# Altium schematic sheet USB JTAG.SchDoc
size A2; SheetNumber: 4; SheetTotal: 12
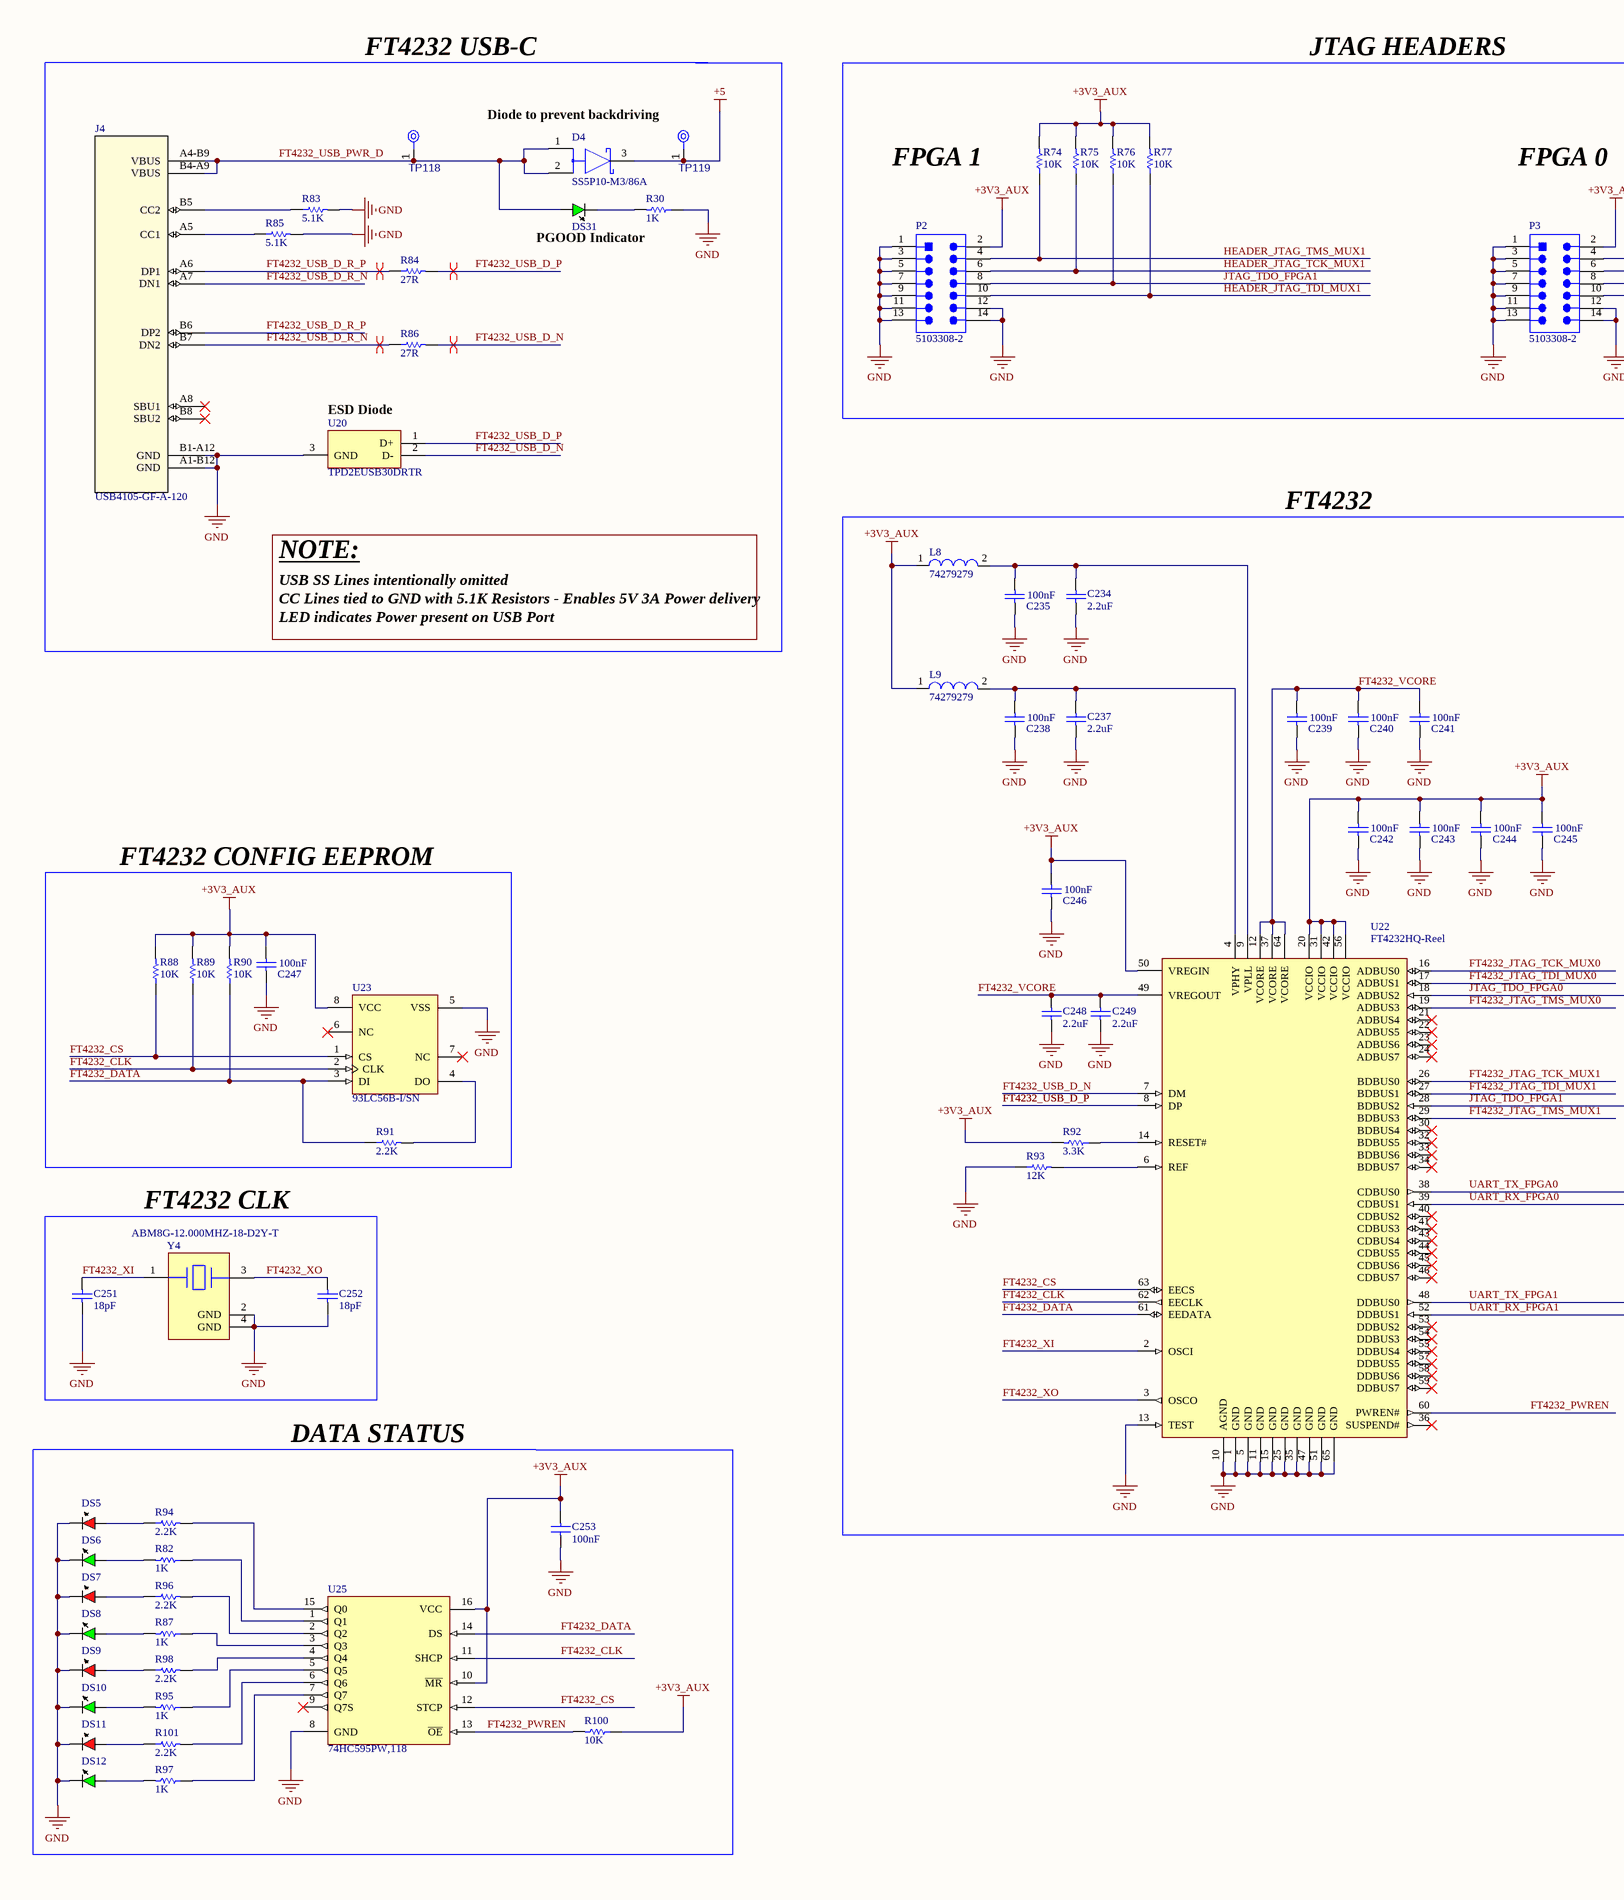
[diagram p0: USB JTAG.SchDoc, left]
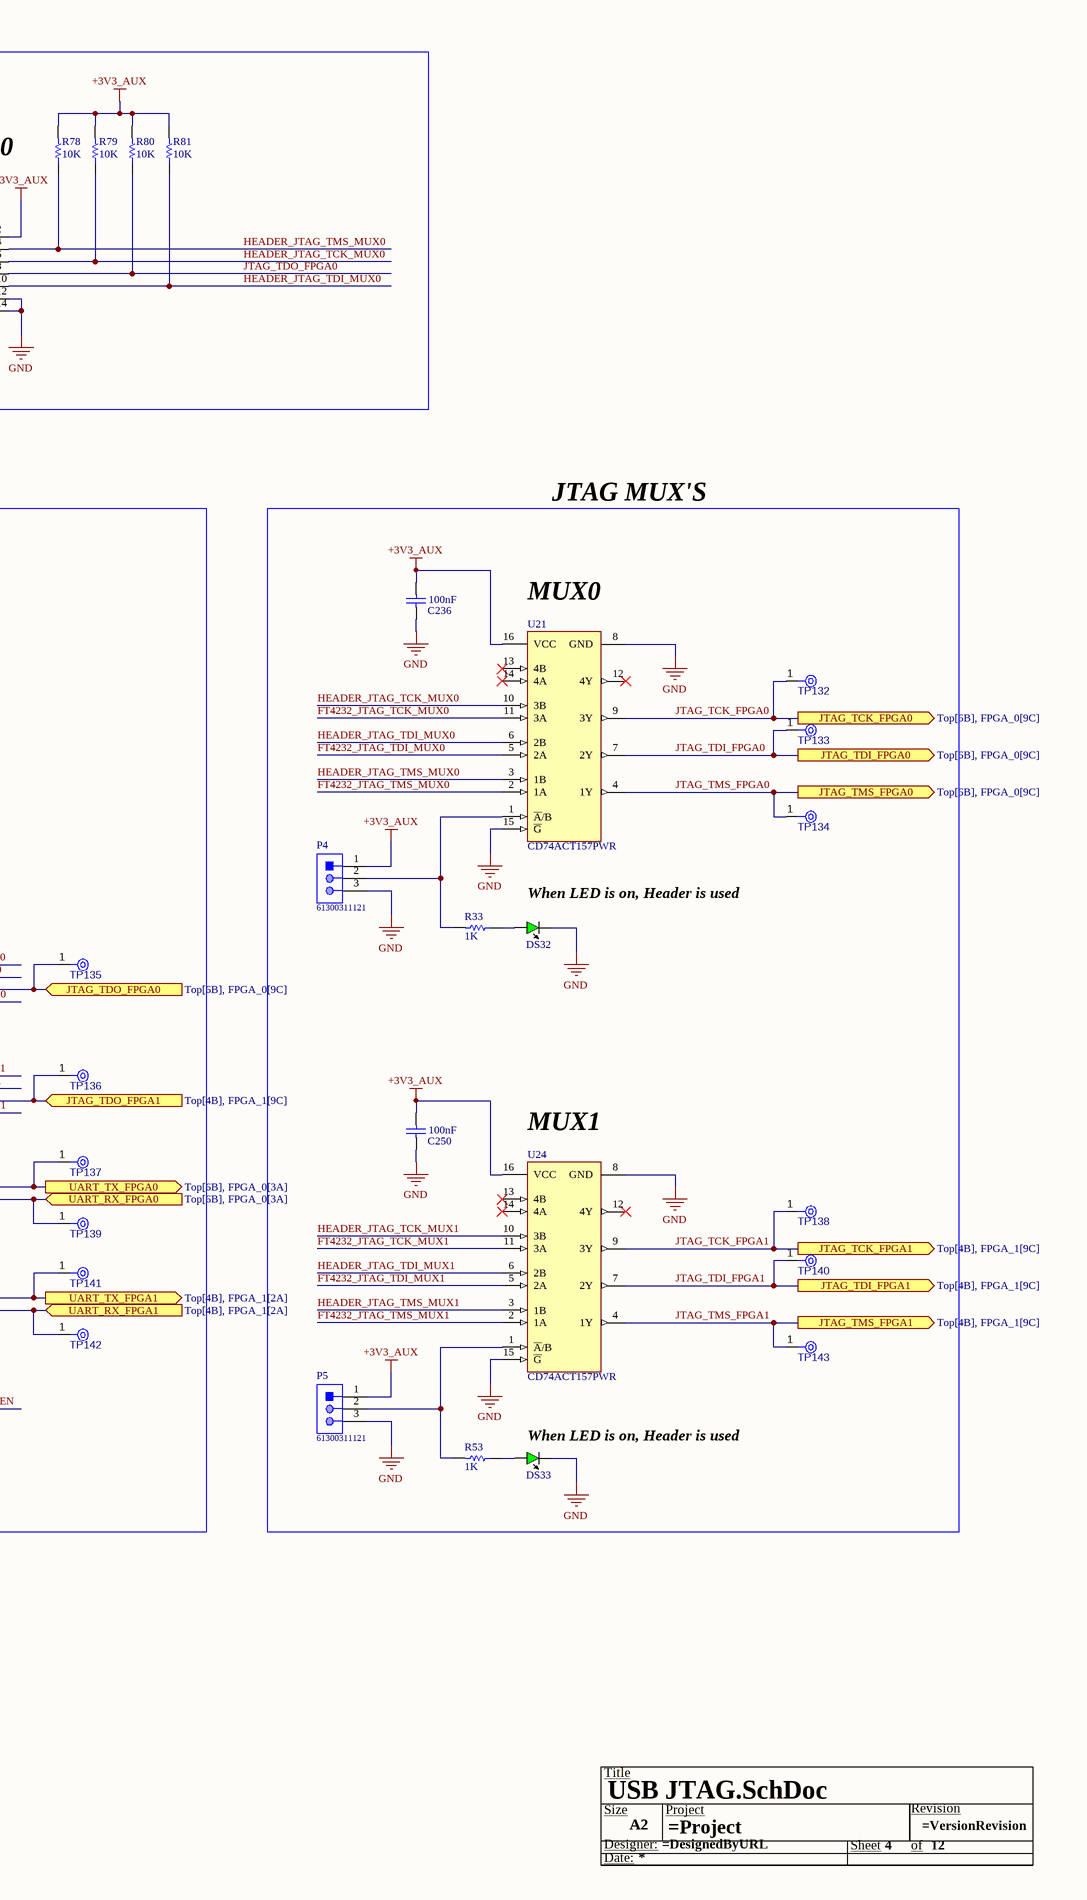
[diagram p1: USB JTAG.SchDoc, right]

## Parts
*  Size: A2  (hidden comment: Title Block)  (graphical)
C234  2.2uF  [CAPC1005X55X25NL05T10]
C235  100nF  [CAPC1005X05N]
C236  100nF  [CAPC1005X05N]
C237  2.2uF  [CAPC1005X55X25NL05T10]
C238  100nF  [CAPC1005X05N]
C239  100nF  [CAPC1005X05N]
C240  100nF  [CAPC1005X05N]
C241  100nF  [CAPC1005X05N]
C242  100nF  [CAPC1005X05N]
C243  100nF  [CAPC1005X05N]
C244  100nF  [CAPC1005X05N]
C245  100nF  [CAPC1005X05N]
C246  100nF  [CAPC1005X05N]
C247  100nF  [CAPC1005X05N]
C248  2.2uF  [CAPC1005X55X25NL05T10]
C249  2.2uF  [CAPC1005X55X25NL05T10]
C250  100nF  [CAPC1005X05N]
C251  18pF  [CAPC1005X55X25LL05T10]
C252  18pF  [CAPC1005X55X25LL05T10]
C253  100nF  [CAPC1005X05N]
D4  SS5P10-M3/86A  [FP-95570-MFG]
DS5  TLMS1100-GS08  [VISH-TLMX1100_V]  (value not drawn)
DS6  SMLLX0603GWTR  [LUMX-SML-LX0603_V]  (value not drawn)
DS7  TLMS1100-GS08  [VISH-TLMX1100_V]  (value not drawn)
DS8  SMLLX0603GWTR  [LUMX-SML-LX0603_V]  (value not drawn)
DS9  TLMS1100-GS08  [VISH-TLMX1100_V]  (value not drawn)
DS10  SMLLX0603GWTR  [LUMX-SML-LX0603_V]  (value not drawn)
DS11  TLMS1100-GS08  [VISH-TLMX1100_V]  (value not drawn)
DS12  SMLLX0603GWTR  [LUMX-SML-LX0603_V]  (value not drawn)
DS31  SMLLX0603GWTR  [LUMX-SML-LX0603_V]  (value not drawn)
DS32  SMLLX0603GWTR  [LUMX-SML-LX0603_V]  (value not drawn)
DS33  SMLLX0603GWTR  [LUMX-SML-LX0603_V]  (value not drawn)
J4  USB4105-GF-A-120  [USB4105-GF-A-120-Footprint-1]
L8  74279279  [SMD-0402]
L9  74279279  [SMD-0402]
P2  5103308-2  [TECO-5103308-2_V]
P3  5103308-2  [TECO-5103308-2_V]
P4  61300311121  [61300311121]
P5  61300311121  [61300311121]
R30  1K  [RESC1005X40X25NL05T10]
R33  1K  [RESC1005X40X25NL05T10]
R53  1K  [RESC1005X40X25NL05T10]
R74  10K  [RESC1005X40X25NL05T10]
R75  10K  [RESC1005X40X25NL05T10]
R76  10K  [RESC1005X40X25NL05T10]
R77  10K  [RESC1005X40X25NL05T10]
R78  10K  [RESC1005X40X25NL05T10]
R79  10K  [RESC1005X40X25NL05T10]
R80  10K  [RESC1005X40X25NL05T10]
R81  10K  [RESC1005X40X25NL05T10]
R82  1K  [RESC1005X40X25NL05T10]
R83  5.1K  [RESC1005X40X25NL05T10]
R84  27R  [RESC1005X40X25NL05T10]
R85  5.1K  [RESC1005X40X25NL05T10]
R86  27R  [RESC1005X40X25NL05T10]
R87  1K  [RESC1005X40X25NL05T10]
R88  10K  [RESC1005X40X25NL05T10]
R89  10K  [RESC1005X40X25NL05T10]
R90  10K  [RESC1005X40X25NL05T10]
R91  2.2K  [RESC1005X40X25NL5T10]
R92  3.3K  [RESC1005X40X25NL05T10]
R93  12K  [RESC1005X40X25NL05T05]
R94  2.2K  [RESC1005X40X25NL5T10]
R95  1K  [RESC1005X40X25NL05T10]
R96  2.2K  [RESC1005X40X25NL5T10]
R97  1K  [RESC1005X40X25NL05T10]
R98  2.2K  [RESC1005X40X25NL5T10]
R100  10K  [RESC1005X40X25NL05T10]
R101  2.2K  [RESC1005X40X25NL5T10]
TP118  TPAD6R  [TP06R]  (value not drawn)  (no BOM)
TP119  TPAD6R  [TP06R]  (value not drawn)  (no BOM)
TP132  TPAD6R  [TP06R]  (value not drawn)  (no BOM)
TP133  TPAD6R  [TP06R]  (value not drawn)  (no BOM)
TP134  TPAD6R  [TP06R]  (value not drawn)  (no BOM)
TP135  TPAD6R  [TP06R]  (value not drawn)  (no BOM)
TP136  TPAD6R  [TP06R]  (value not drawn)  (no BOM)
TP137  TPAD6R  [TP06R]  (value not drawn)  (no BOM)
TP138  TPAD6R  [TP06R]  (value not drawn)  (no BOM)
TP139  TPAD6R  [TP06R]  (value not drawn)  (no BOM)
TP140  TPAD6R  [TP06R]  (value not drawn)  (no BOM)
TP141  TPAD6R  [TP06R]  (value not drawn)  (no BOM)
TP142  TPAD6R  [TP06R]  (value not drawn)  (no BOM)
TP143  TPAD6R  [TP06R]  (value not drawn)  (no BOM)
U20  TPD2EUSB30DRTR  [DRT0003A]
U21  CD74ACT157PWR  [PW0016A_L]
U22  FT4232HQ-Reel  [QFN64_2_M]
U23  93LC56B-I/SN  [SOIC-SN8_L]
U24  CD74ACT157PWR  [PW0016A_L]
U25  74HC595PW,118  [FP-SOT403-1-MFG]
Y4  ABM8G-12.000MHZ-18-D2Y-T  [FP-ABM8G-MFG]

## Blocks framed on the sheet
FT4232: C234 C235 C237-C246 C248 C249 L8 L9 R92 R93 TP135-TP137 TP139 TP141 TP142 U22
FT4232 CONFIG EEPROM: C247 R88-R91 U23
FT4232 CLK: C251 C252 Y4
DATA STATUS: C253 DS5-DS12 R82 R87 R94-R98 R100 R101 U25

## Ports
JTAG_TCK_FPGA0 (out, see Top[6B], FPGA_0[9C]), JTAG_TCK_FPGA1 (out, see Top[4B], FPGA_1[9C]), JTAG_TDI_FPGA0 (out, see Top[6B], FPGA_0[9C]), JTAG_TDI_FPGA1 (out, see Top[4B], FPGA_1[9C]), JTAG_TDO_FPGA0 (in, see Top[6B], FPGA_0[9C]), JTAG_TDO_FPGA1 (in, see Top[4B], FPGA_1[9C]), JTAG_TMS_FPGA0 (out, see Top[6B], FPGA_0[9C]), JTAG_TMS_FPGA1 (out, see Top[4B], FPGA_1[9C]), UART_RX_FPGA0 (in, see Top[6B], FPGA_0[3A]), UART_RX_FPGA1 (in, see Top[4B], FPGA_1[2A]), UART_TX_FPGA0 (out, see Top[6B], FPGA_0[3A]), UART_TX_FPGA1 (out, see Top[4B], FPGA_1[2A])

## Nets
+3V3_AUX: C236.2 C242.2 C243.2 C244.2 C245.2 C246.2 C247.2 C250.2 C253.2 L8.1 L9.1 P2.2 P3.2 P4.1 P5.1 R74.2 R75.2 R76.2 R77.2 R78.2 R79.2 R80.2 R81.2 R88.2 R89.2 R90.2 R92.2 R100.1 U21.16(VCC) U22.20(VCCIO) U22.31(VCCIO) U22.42(VCCIO) U22.50(VREGIN) U22.56(VCCIO) U23.8(VCC) U24.16(VCC) U25.10(~{MR}) U25.16(VCC)
+5: D4.3(C) TP119.1(TP)
GND: C234.1 C235.1 C236.1 C237.1 C238.1 C239.1 C240.1 C241.1 C242.1 C243.1 C244.1 C245.1 C246.1 C247.1 C248.1 C249.1 C250.1 C251.1 C252.1 C253.1 DS5.2(K) DS6.2(K) DS7.2(K) DS8.2(K) DS9.2(K) DS10.2(K) DS11.2(K) DS12.2(K) DS32.2(K) DS33.2(K) J4.A1-B12(GND) J4.B1-A12(GND) P2.1 P2.3 P2.5 P2.7 P2.9 P2.11 P2.12 P2.13 P2.14 P3.1 P3.3 P3.5 P3.7 P3.9 P3.11 P3.12 P3.13 P3.14 P4.3 P5.3 R30.1 R83.2 R85.2 R93.1 U20.3(GND) U21.8(GND) U21.15(~{G}) U22.1(GND) U22.5(GND) U22.10(AGND) U22.11(GND) U22.13(TEST) U22.15(GND) U22.25(GND) U22.35(GND) U22.47(GND) U22.51(GND) U22.65(GND) U23.5(VSS) U24.8(GND) U24.15(~{G}) U25.8(GND) Y4.2(GND) Y4.4(GND)
FT4232_CLK: R89.1 U22.62(EECLK) U23.2(CLK) U25.11(SHCP)
FT4232_CS: R88.1 U22.63(EECS) U23.1(CS) U25.12(STCP)
FT4232_DATA: R90.1 R91.1 U22.61(EEDATA) U23.3(DI) U25.14(DS)
FT4232_JTAG_TCK_MUX0: U21.11(3A) U22.16(ADBUS0)
FT4232_JTAG_TCK_MUX1: U22.26(BDBUS0) U24.11(3A)
FT4232_JTAG_TDI_MUX0: U21.5(2A) U22.17(ADBUS1)
FT4232_JTAG_TDI_MUX1: U22.27(BDBUS1) U24.5(2A)
FT4232_JTAG_TMS_MUX0: U21.2(1A) U22.19(ADBUS3)
FT4232_JTAG_TMS_MUX1: U22.29(BDBUS3) U24.2(1A)
FT4232_PWREN: R100.2 U22.60(PWREN#) U25.13(~{OE})
FT4232_USB_D_N: R86.2 U20.2(D-) U22.7(DM)
FT4232_USB_D_P: R84.2 U20.1(D+) U22.8(DP)
FT4232_USB_D_R_N: J4.A7(DN1) J4.B7(DN2) R86.1
FT4232_USB_D_R_P: J4.A6(DP1) J4.B6(DP2) R84.1
FT4232_USB_PWR_D: D4.1(A) D4.2(A) DS31.1(A) J4.A4-B9(VBUS) J4.B4-A9(VBUS) TP118.1(TP)
FT4232_VCORE: C239.2 C240.2 C241.2 C248.2 C249.2 U22.12(VCORE) U22.37(VCORE) U22.49(VREGOUT) U22.64(VCORE)
FT4232_XI: C251.2 U22.2(OSCI) Y4.1
FT4232_XO: C252.2 U22.3(OSCO) Y4.3
HEADER_JTAG_TCK_MUX0: P3.6 R79.1 U21.10(3B)
HEADER_JTAG_TCK_MUX1: P2.6 R75.1 U24.10(3B)
HEADER_JTAG_TDI_MUX0: P3.10 R81.1 U21.6(2B)
HEADER_JTAG_TDI_MUX1: P2.10 R77.1 U24.6(2B)
HEADER_JTAG_TMS_MUX0: P3.4 R78.1 U21.3(1B)
HEADER_JTAG_TMS_MUX1: P2.4 R74.1 U24.3(1B)
JTAG_TCK_FPGA0: TP132.1(TP) U21.9(3Y) ; port JTAG_TCK_FPGA0
JTAG_TCK_FPGA1: TP138.1(TP) U24.9(3Y) ; port JTAG_TCK_FPGA1
JTAG_TDI_FPGA0: TP133.1(TP) U21.7(2Y) ; port JTAG_TDI_FPGA0
JTAG_TDI_FPGA1: TP140.1(TP) U24.7(2Y) ; port JTAG_TDI_FPGA1
JTAG_TDO_FPGA0: P3.8 R80.1 TP135.1(TP) U22.18(ADBUS2) ; port JTAG_TDO_FPGA0
JTAG_TDO_FPGA1: P2.8 R76.1 TP136.1(TP) U22.28(BDBUS2) ; port JTAG_TDO_FPGA1
JTAG_TMS_FPGA0: TP134.1(TP) U21.4(1Y) ; port JTAG_TMS_FPGA0
JTAG_TMS_FPGA1: TP143.1(TP) U24.4(1Y) ; port JTAG_TMS_FPGA1
UART_RX_FPGA0: TP139.1(TP) U22.39(CDBUS1) ; port UART_RX_FPGA0
UART_RX_FPGA1: TP142.1(TP) U22.52(DDBUS1) ; port UART_RX_FPGA1
UART_TX_FPGA0: TP137.1(TP) U22.38(CDBUS0) ; port UART_TX_FPGA0
UART_TX_FPGA1: TP141.1(TP) U22.48(DDBUS0) ; port UART_TX_FPGA1
NetC234_2: C234.2 C235.2 L8.2 U22.9(VPLL)
NetC237_2: C237.2 C238.2 L9.2 U22.4(VPHY)
NetDS5_1: DS5.1(A) R94.1
NetDS6_1: DS6.1(A) R82.2
NetDS7_1: DS7.1(A) R96.1
NetDS8_1: DS8.1(A) R87.2
NetDS9_1: DS9.1(A) R98.1
NetDS10_1: DS10.1(A) R95.2
NetDS11_1: DS11.1(A) R101.1
NetDS12_1: DS12.1(A) R97.2
NetDS31_2: DS31.2(K) R30.2
NetDS32_1: DS32.1(A) R33.1
NetDS33_1: DS33.1(A) R53.1
NetJ4_A5: J4.A5(CC1) R85.1
NetJ4_B5: J4.B5(CC2) R83.1
NetP4_2: P4.2 R33.2 U21.1(~{A}/B)
NetP5_2: P5.2 R53.2 U24.1(~{A}/B)
NetR82_1: R82.1 U25.1(Q1)
NetR87_1: R87.1 U25.3(Q3)
NetR91_2: R91.2 U23.4(DO)
NetR92_1: R92.1 U22.14(RESET#)
NetR93_2: R93.2 U22.6(REF)
NetR94_2: R94.2 U25.15(Q0)
NetR95_1: R95.1 U25.5(Q5)
NetR96_2: R96.2 U25.2(Q2)
NetR97_1: R97.1 U25.7(Q7)
NetR98_2: R98.2 U25.4(Q4)
NetR101_2: R101.2 U25.6(Q6)

Not connected (* = marked no-connect by the designer): J4 A8(SBU1)* B8(SBU2)*; U21 12(4Y)* 13(4B)* 14(4A)*; U22 21(ADBUS4)* 22(ADBUS5)* 23(ADBUS6)* 24(ADBUS7)* 30(BDBUS4)* 32(BDBUS5)* 33(BDBUS6)* 34(BDBUS7)* 36(SUSPEND#)* 40(CDBUS2)* 41(CDBUS3)* 43(CDBUS4)* 44(CDBUS5)* 45(CDBUS6)* 46(CDBUS7)* 53(DDBUS2)* 54(DDBUS3)* 55(DDBUS4)* 57(DDBUS5)* 58(DDBUS6)* 59(DDBUS7)*; U23 6(NC)* 7(NC)*; U24 12(4Y)* 13(4B)* 14(4A)*; U25 9(Q7S)*

## Layout directives
differential pair: FT4232_USB_D_N, FT4232_USB_D_P, FT4232_USB_D_R_N, FT4232_USB_D_R_P

## Notes on the sheet
- FT4232 USB-C
- JTAG HEADERS
- Diode to prevent backdriving
- FPGA 1
- FPGA 0
- PGOOD Indicator
- (near U20) ESD Diode
- JTAG MUX'S
- NOTE:
- USB SS Lines intentionally omitted
- CC Lines tied to GND with 5.1K Resistors - Enables 5V 3A Power delivery
- LED indicates Power present on USB Port
- (near U21) MUX0
- (near DS32) When LED is on, Header is used
- (near U24) MUX1
- (near DS33) When LED is on, Header is used
- (in symbol CMP-007-000006-8) Title; Size; Project; Revision; Designer:; Sheet; of; Date:

## Library data of the parts
* = CMP-007-000006-8: Generic Title Block
C234 C237 C248 C249 = CMP-2008-04543-1: GRM155R60J225ME15D; Manufacturer: Murata; Part Number: GRM155R60J225ME15D
C235 C236 C238-C247 C250 C253 = CMP-001-00095-1: Cap Ceramic 0.1uF 50V X7R 20% SMD 0402 125°C Paper T/R GRM155R71H104ME14J; Voltage: 50V; Capacitance: 100nF; Case: 0402
C251 C252 = CMP-2000-06328-1: Chip Capacitor, 18 pF, +/- 5%, 50 V, -55 to 125 degC, 0402 (1005 Metric), RoHS, Tape and Reel GRM1555C1H180JZ01D; Manufacturer: Murata; Other Names: 490-1281-6; Voltage - Rated: 50V; Temperature Coefficient: C0G,NP0; Catalog Drawings: GRMSeries_0402(0.5mmThickness); Applications: GeneralPurpose; Datasheet Version: 10/2016; Mounting Type: SurfaceMount,MLCC; Features: -; Package Reference: 0402; Thickness (Max): 0.022"(0.55mm); Capacitance: 18pF; Height - Seated (Max): -; Size / Dimension: 0.039"Lx0.020"W(1.00mmx0.50mm); Package / Case: 0402(1005Metric); Lead Style: -; Series: GRM; Mounting Technology: SurfaceMount; Package Description: 2-Pin Surface Mount Device, Body 1 x 0.5 mm; Family: CeramicCapacitors; Tolerance: ±5%; Category: Capacitors; Datasheet URL: http://psearch.en.murata.com/capacitor/product/GRM1555C1H180JZ01_.pdf; Ratings: -; Lead Spacing: -; Standard Package: 1; Operating Temperature: -55°C~125°C; Packaging: Digi-Reel®; Manufacturer URL: http://www.murata.com/
D4 = CMP-02539-000057-1: DIODE SCHOTTKY 100V 5A TO277A; Max Forward Surge Current (Ifsm): 150A; Element Configuration: Common Cathode; Max Reverse Leakage Current: 15uA; Forward Voltage: 880mV; Case/Package: TO-277A; Number of Pins: 3; Max Reverse Voltage (DC): 100V; Height: 0.031inch; Peak Non-Repetitive Surge Current: 150A; Series: eSMP®; Radiation Hardening: No; Length: 0.242inch; Max Repetitive Reverse Voltage (Vrrm): 100V; Forward Current: 5A; Width: 0.171inch; Min Operating Temperature: -55°C; Max Surge Current: 150A; Lead Free: Lead Free; RoHS Compliant: Yes; Average Rectified Current: 5A; Max Operating Temperature: 150°C; Max Reverse Current: 15uA; Package Quantity: 1500; Packaging: Tape and Reel; Mount: Surface Mount
DS5 DS7 DS9 DS11 = CMP-007-00036-1: LED Uni-Color Red 633nm Automotive 2-Pin Chip 0603(1608Metric) T/R; Case/Package: SMD/SMT; Color: Red
DS6 DS8 DS10 DS12 DS31-DS33 = CMP-007-00037-1: LED GREEN DIFFUSED SMD; Color: Green; Case/Package: 0603
J4 = CMP-002-00073-2: USB CONN, 2.0 TYPE C, RCPT, 16POS, SMT; USB Connector Type: USB Type C; USB Standard: USB 2.0; Gender: Receptacle;...
L8 L9 = CMP-0220-00109-1: SMD EMI Suppression Ferrite Bead WE-CBF, Z = 600 Ohm; Impedance: 600 Ohm; ComponentLink2Description: Datasheet; ComponentLink1Description: Manufacturer Link; PackageReference: SMD-0402; PackageVersion: 2009; ComponentLink1URL: http://www.we-online.com; PackageDescription: Chip Inductor, 2-Leads, Body 1.0 x 0.5 mm; DatasheetVersion: ver 6, Jul-2009; ComponentLink2URL: http://www.we-online.de/katalog/media/pdf/74279279.pdf
P2 P3 = CMP-2000-05623-1: Male Header, Pitch 2.54 mm, 2 x 7 Position, Height 9.8552 mm, Tail Length 3.048 mm, -65 to 105 degC, RoHS, Rail/Tube; Manufacturer: TE Connectivity; Featured Product: AMP-LATCHRibbonCableConnectors; Mating Products: 1658527-5-ND / -CONNRCPT14POS.100POLARGOLD / 1658526-9-ND / -CONNRCPT14POSVERTGOLDW/SR / 1658526-8-ND / -CONNRCPT14POSVERTGOLD / ASC14B-ND / -CONNIDCSOCKET14POSGOLD / ASC14H-ND / -CONNIDCSOCKET14POS15GOLD / AKC14B-ND / -CONNIDCSKT14POSW/POLGOLD / AKC14H-ND / -CONNIDCSKT14POSW/POL15GOLD / 487223-2-ND / -014HOUSINGFFCRCPT100CLDR; Other Names: A33161; Number of Positions: 14; Dynamic Catalog: AMP-LatchSeries; Catalog Drawings: LowProfileShroudedStraight; Pitch: 0.100"(2.54mm); 3D Model: 5103308-2.pdf; Connector Type: Header,Shrouded; Number of Positions Loaded: All; RoHS Information: 5103308-2StatementofCompliance; Datasheet URL: http://www.te.com/commerce/DocumentDelivery/DDEController?Action=srchrtrv&DocNm=5103308&DocType=Customer+Drawing&DocLang=English&DocFormat=pdf&PartCntxt=5103308-2; Mounting Type: ThroughHole; Packaging: Tube; Standard Package: 100; Category: Connectors,Interconnects; Number of Rows: 2; Package Description: Male Header, Pitch 2.54 mm, 2 x 7 Position, Height 9.8552 mm, Tail Length 3.048 mm; Termination: Solder; Contact Mating Length: 0.240"(6.10mm); Color: Black; Contact Finish: GoldorGold-Palladium; Manufacturer URL: http://www.te.com/; Family: RectangularConnectors-Headers,MalePins; Row Spacing: 0.100"(2.54mm); Package Reference: 5103308-2; Contact Type: MalePin; Contact Finish Thickness: 15µin(0.38µm); Mounting Technology: ThroughHole; Series: AMP-Latch; Datasheet Version: Rev. E, 03/2011
P4 P5 = CMP-1502-01062-1: THT Vertical Pin Header WR-PHD, Pitch 2.54 mm, Single Row, 3 pins; Manufacturer: Wurth Elektronik; Withstanding Voltage: 500VAC; Working Voltage: 250VAC; Rated Current: 3A; Pitch: 2.54mm; Pin Number: 3; Gender: Male; Contact Resistance: 20mOhm; Package Reference: 61300311121; Manufacturer URL: http://www.we-online.de; Datasheet URL: https://katalog.we-online.de/em/datasheet/6130xx11121.pdf; Operating Temperature: -40to105degC; Part Number: 61300311121; Orientation: Vertical; Packaging: Bag; Row Number: Single; Mounting Technology: THT; Publisher: WurthElektronik
R30 R33 R53 R82 R87 R95 R97 = CMP-2002-03045-1: CRCW04021K00FKEDHP; Manufacturer: Vishay Dale; Part Number: CRCW04021K00FKEDHP
R74-R81 R88-R90 R100 = CMP-2002-07353-1: RC0402FR-0710KL; Manufacturer: Yageo / Phycomp; Part Number: RC0402FR-0710KL
R83 R85 = CMP-2002-07753-1: RC0402FR-075K1L; Manufacturer: Yageo / Phycomp; Part Number: RC0402FR-075K1L
R84 R86 = CMP-1011-00036-2: RC0402JR-0727RL; Manufacturer: Yageo / Phycomp; Part Number: RC0402JR-0727RL
R91 R94 R96 R98 R101 = CMP-2002-07969-2: Chip Resistor, 2.2 KOhm, +/- 5%, 0.063 W, -55 to 155 degC, 0402 (1005 Metric), RoHS, Tape and Reel RC0402JR-072K2L; Voltage Rating (DC): 50 V; Case\Package: 0402; Power Rating: 63 mW; Case Code (Metric): 1005; PackageDescription: 2-Pin Surface Mount Device, Body 1 x 0.5 mm; ComponentLink2URL: http://www.yageo.com/documents/recent/PYu-RC_Group_51_RoHS_L_04.pdf; PackageReference: 0402; Packaging: Tape and Reel; Width: 0.5 mm; REACH SVHC: No SVHC; Tolerance: 5%; Mount: Surface Mount; Mounting Technology: Surface Mount; RoHSCompliant: true; ComponentLink1Description: Manufacturer URL; ComponentLink2Description: Datasheet; Voltage Rating: 50 V; Min Operating Temperature: -55 degC; ComponentLink1URL: http://www.yageo.com/; Resistance: 2.2 kohm; Max Operating Temperature: 155 degC; Height: 0.35 mm; Package Quantity: 10000; Pins: 2; Length: 1 mm; Case Code (Imperial): 0402; DatasheetVersion: Rev. 4, 02/2016
R92 = CMP-2002-03055-1: CRCW04023K30FKEDHP; Manufacturer: Vishay Dale; Part Number: CRCW04023K30FKEDHP
R93 = CMP-1011-00631-2: CRCW040212K0FKED; Manufacturer: Vishay Dale; Part Number: CRCW040212K0FKED
TP118 TP119 TP132-TP143 = CMP-00028-00002-1: 0.6mm round; Pins: 1
U20 = CMP-0326-00046-3: ESD Solution for Super-Speed (6 Gbps) USB 3.0 Interface, 2 Channels, -40 to +85 degC, 3-pin SOT (DRT), Green (Rohs & No Sb/Br); Manufacturer: Texas Instruments; Differential Capacitance(pF): 0.01; Breakdown Voltage(Min)(V): 9; HDMI: TRUE; IEC 61000-4-2 Air-Gap(+/- kV): 8; IO Leakage Current(nA): 10; IO Capacitance(Typ)(pF): 0.7; Mounting Technology: Surface Mount; PackageDescription: 3-Flat Lead Plastic Small Outline, 1 x 1 mm (inc leads), 0.35 mm Pitch; IEC 61000-4-2 Contact(+/- kV): 8; USB Super Speed: TRUE; Eco-Plan: Green (RoHS & no Sb/Br); USB High Speed: TRUE; PackageReference: DRT0003A; SubFamily: ESD Solution; USB Full Speed: TRUE; ComponentLink1Description: Datasheet; ComponentLink2URL: SamplesURL:http://www.ti.com/product/tpd2eusb30#samples; PackageVersion: revD, Jun-2008; ComponentLink2Description: URL Link1; 1394 / Firewire: TRUE; PartNumber: TPD2EUSB30DRTR; ComponentLink1URL: http://www.ti.com/general/docs/lit/getliterature.tsp?genericPartNumber=TPD2EUSB30&fileType=pdf; DatasheetVersion: SLVSAC2C; Serial ATA / eSATA: TRUE
U21 U24 = CMP-1633-00824-2: Quad Non-Inverting 2-Input Multiplexers, PW0016A, LARGE T&R; Manufacturer: Texas Instruments; tpd @ Nom Voltage(Max)(ns): 8.6; Function: Encoder/Multiplexer; Voltage(Nom)(V): 5; F @ Nom Voltage(Max)(Mhz): 90; Output Type: CMOS; Configuration: 2：1; Rating: Catalog; VCC(Max)(V): 5.5; Output Drive (IOL/IOH)(Max)(mA): 24/-24; ICC @ Nom Voltage(Max)(mA): 0.08; Channels(#): 4; VCC(Min)(V): 4.5; Technology Family: ACT; Input Type: TTL; Bits(#): 2; Schmitt Trigger: No; Type: Standard; PackageReference: PW0016A; Code_JEDEC: MO-153; Operating Temperature Range(C): -55 to 125; Generic Part Number: CD74ACT157; DatasheetVersion: SCHS340B
U22 = CMP-0078-00005-3: Quad High Speed USB To Multipurpose UART/MPSSE IC, 64-pin QFN, Tape and Reel; Manufacturer: FTDI; ComponentLink1URL: http://www.ftdichip.com/; ComponentLink2Description: Datasheet; ComponentLink2URL: http://www.ftdichip.com/Support/Documents/DataSheets/ICs/DS_FT4232H.pdf; PackageReference: QFN64_2; DatasheetVersion: ver 2.2, Jan-2012; PackageDescription: 64-Pin Quad Flat No-Lead, 9 x 9 mm Body, 0.5 mm Pitch, 4.35 x 4.35 mm Exposed Pad; RevisionNote: DatasheetVersion updated to 2.2 Jan-2012; PartNumber: FT4232HQ-Reel; PackageVersion: Jan-12; ComponentLink1Description: Manufacturer URL
U23 = CMP-0162-00077-1: 2K, 128x16-bit, 2.5V Microwire Serial EEPROM, 8-Pin SOIC 150mil, Industrial Temperature; Code_IPC: SOIC127P600-8; PackageVersion: revBB, Aug-2009; PackageDescription: 8-Lead Plastic Small Outline (SN) - Narrow, 3.90mm Body [SOIC]; DatasheetVersion: revF, May-2008; PackageReference: SOIC-SN8; Code_JEDEC: MS-012
U25 = CMP-14351-000004-1: IC SHIFT REGISTER 8BIT 16TSSOP
Y4 = CMP-2000-05039-3: Crystal 12MHz ±20ppm (Tol) ±30ppm (Stability) 18pF FUND 120Ω 4-Pin SMD T/R; Series Resistance: 120R; Max Operating Temperature: 85°C; Mount: Surface Mount; Width: 2.5mm; Series: ABM8G; Termination: SMD/SMT; Frequency Tolerance: 20ppm; Tolerance: 20ppm; Min Operating Temperature: -40°C; Operating Frequency: 12 MHz; Depth: 2.5mm; Load Capacitance: 18pF; Number of Pins: 4; Length: 3.2mm; Radiation Hardening: No; Frequency Stability: 30ppm; Height: 1mm; Packaging: Tape and Reel; Package Quantity: 1000; ESR (Equivalent Series Resistance): 120R; Lead Free: Lead Free; Frequency: 12MHz; Case/Package: CSMD